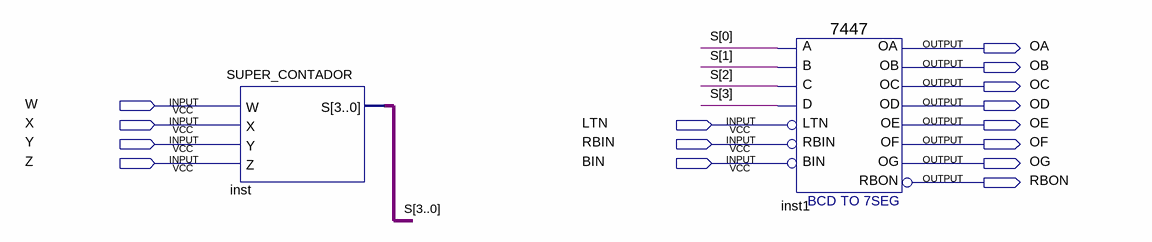
[diagram p0: schematic sheet]
// Quartus schematic CONTADOR.bdf as structural Verilog: 2 symbols, 15 pins
module CONTADOR (
  input  W,
  input  X,
  input  LTN,
  input  Y,
  input  RBIN,
  input  Z,
  input  BIN,
  output OA,
  output OB,
  output OC,
  output OD,
  output OE,
  output OF,
  output OG,
  output RBON
);

  wire [3:0] S;

  SUPER_CONTADOR inst (.W(W), .X(X), .Y(Y), .Z(Z), .S(S));
  \7447  inst1 (
    .LTN(LTN), .B(S[1]), .C(S[2]), .D(S[3]), .RBIN(RBIN), .BIN(BIN), .A(S[0]), .OB(OB), .OC(OC), .OE(OE),
    .OD(OD), .OF(OF), .OG(OG), .OA(OA), .RBON(RBON));
endmodule
